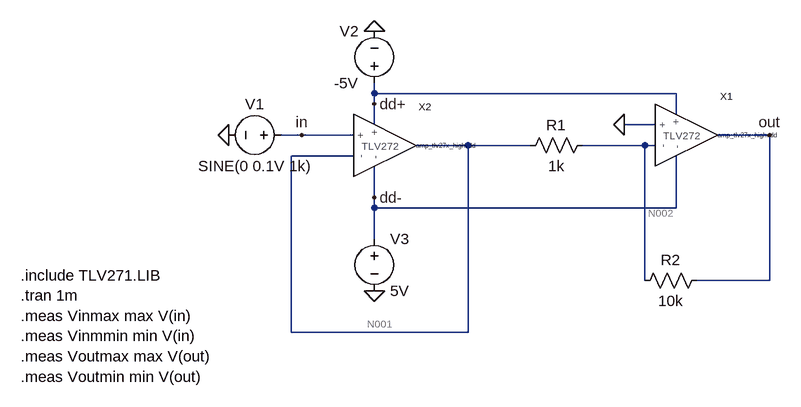
[diagram p0: schematic Exercise8.asc]
Exercise8.asc, the LTspice schematic file:
Version 4.1
SHEET 1 880 680
WIRE 160 -16 160 -32
WIRE 624 -16 160 -16
WIRE 160 0 160 -16
WIRE 624 16 624 -16
WIRE 160 32 160 0
WIRE 592 32 544 32
WIRE 48 48 16 48
WIRE 128 48 48 48
WIRE 768 48 688 48
WIRE 304 64 224 64
WIRE 400 64 304 64
WIRE 576 64 480 64
WIRE 592 64 576 64
WIRE 128 80 32 80
WIRE 160 144 160 96
WIRE 160 160 160 144
WIRE 624 160 624 80
WIRE 624 160 160 160
WIRE 160 208 160 160
WIRE 576 272 576 64
WIRE 768 272 768 48
WIRE 768 272 656 272
WIRE 32 352 32 80
WIRE 304 352 304 64
WIRE 304 352 32 352
FLAG 544 32 0
FLAG 160 -112 0
FLAG 160 288 0
FLAG -64 48 0
FLAG 768 48 out
FLAG 48 48 in
FLAG 160 0 dd+
FLAG 160 144 dd-
SYMBOL EEL3111C\\amp_tlv27x_highVdd 224 64 R0
WINDOW 3 0 0 Left 0
SYMATTR Value amp_tlv27x_highvdd
SYMATTR InstName X2
SYMATTR Prefix X
SYMBOL voltage 32 48 R90
WINDOW 0 -32 56 VBottom 2
WINDOW 3 32 56 VTop 2
WINDOW 123 0 0 Left 0
WINDOW 39 0 0 Left 0
SYMATTR InstName V1
SYMATTR Value SINE(0 0.1V 1k)
SYMBOL res 496 48 R90
WINDOW 0 0 56 VBottom 2
WINDOW 3 32 56 VTop 2
SYMATTR InstName R1
SYMATTR Value 1k
SYMBOL EEL3111C\\amp_tlv27x_highVdd 688 48 R0
WINDOW 3 0 0 Left 0
SYMATTR Value amp_tlv27x_highvdd
SYMATTR InstName X1
SYMATTR Prefix X
SYMBOL voltage 160 -16 R180
WINDOW 0 24 96 Left 2
WINDOW 3 24 16 Left 2
WINDOW 123 0 0 Left 0
WINDOW 39 0 0 Left 0
SYMATTR InstName V2
SYMATTR Value -5V
SYMBOL voltage 160 192 R0
WINDOW 123 0 0 Left 0
WINDOW 39 0 0 Left 0
SYMATTR InstName V3
SYMATTR Value 5V
SYMBOL res 672 256 R90
WINDOW 0 0 56 VBottom 2
WINDOW 3 32 56 VTop 2
SYMATTR InstName R2
SYMATTR Value 10k
TEXT -384 264 Left 2 !.include TLV271.LIB\n.tran 1m\n.meas Vinmax max V(in)\n.meas Vinmmin min V(in)\n.meas Voutmax max V(out)\n.meas Voutmin min V(out)

The netlist it stands for:
* Exercise8.asc
X§X2 N001 in dd+ dd- N001 amp_tlv27x_highVdd params: amp_tlv27x_highvdd  ; pins 1 2 3 4 5
V1 in 0 SINE(0 0.1V 1k)
R1 N002 N001 1k
X§X1 N002 0 dd+ dd- out amp_tlv27x_highVdd params: amp_tlv27x_highvdd  ; pins 1 2 3 4 5
V2 dd+ 0 -5V
V3 dd- 0 5V
R2 out N002 10k
.include TLV271.LIB
.tran 1m
.meas Vinmax max V(in)
.meas Vinmmin min V(in)
.meas Voutmax max V(out)
.meas Voutmin min V(out)
.backanno
.end

* Results of the author's LTspice run, read from the files saved beside the schematic
* Operating Point, zero values left out:
*   V(dd+) = -5 V
*   V(dd-) = 5 V
*   V(n001) = 272.4 nV
*   V(n002) = -45.03 mV
*   V(out) = 7.4 µV
*   I(R1) = -45.03 µA
*   I(R2) = 4.504 µA
*   I(V1) = -74.22 µA
*   I(V2) = 17.01 TA
*   I(V3) = -17.01 TA
*   Ix(x1:1) = 49.54 µA
*   Ix(x1:2) = 98.23 µA
*   Ix(x1:3) = -8.507 TA
*   Ix(x1:4) = 8.507 TA
*   Ix(x1:5) = -4.504 µA
*   Ix(x2:1) = 74.22 µA
*   Ix(x2:2) = 74.22 µA
*   Ix(x2:3) = -8.507 TA
*   Ix(x2:4) = 8.507 TA
*   Ix(x2:5) = -119.3 µA